# Altium schematic sheet Bloc diagram.SchDoc
size A3; SheetNumber: 2; SheetTotal: 5
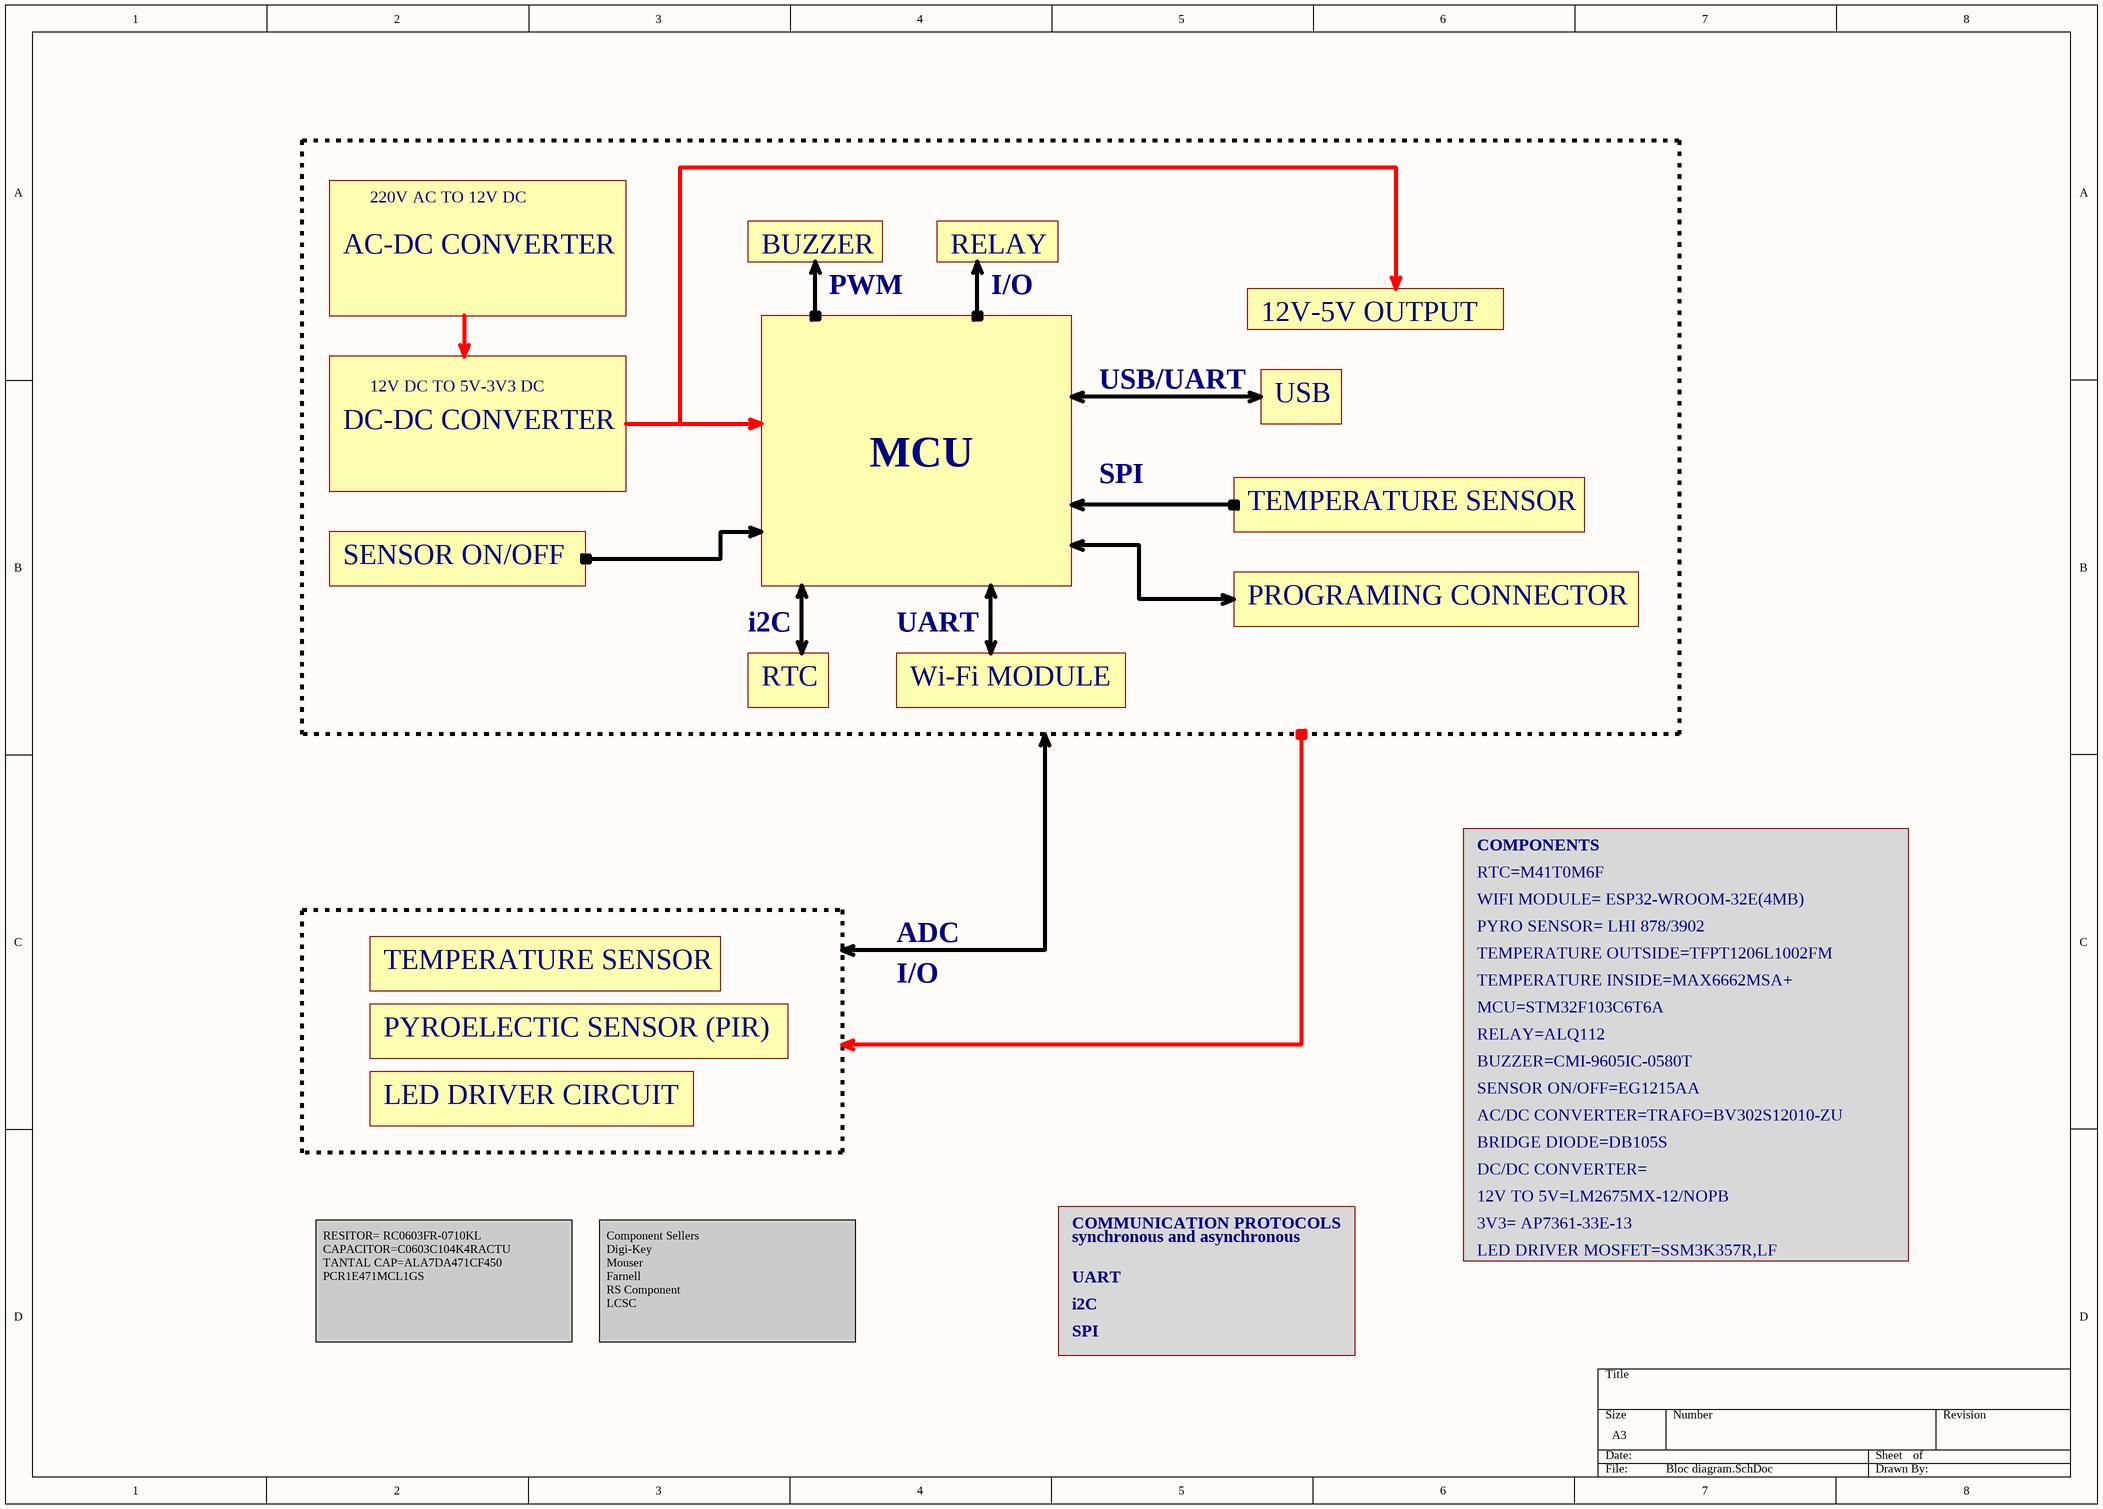
[diagram p0: Bloc diagram.SchDoc]

## Notes on the sheet
- 220V AC TO 12V DC
- AC-DC CONVERTER
- BUZZER
- PWM
- RELAY
- I/O
- 12V-5V OUTPUT
- DC-DC CONVERTER
- 12V DC TO 5V-3V3 DC
- USB/UART
- USB
- MCU
- SPI
- TEMPERATURE SENSOR
- SENSOR ON/OFF
- i2C
- UART
- PROGRAMING CONNECTOR
- RTC
- Wi-Fi MODULE
- COMPONENTS
- RTC=M41T0M6F
- WIFI MODULE= ESP32-WROOM-32E(4MB)
- ADC
- PYRO SENSOR= LHI 878/3902
- TEMPERATURE OUTSIDE=TFPT1206L1002FM
- TEMPERATURE INSIDE=MAX6662MSA+
- PYROELECTIC SENSOR (PIR)
- MCU=STM32F103C6T6A
- RELAY=ALQ112
- LED DRIVER CIRCUIT
- BUZZER=CMI-9605IC-0580T
- SENSOR ON/OFF=EG1215AA
- AC/DC CONVERTER=TRAFO=BV302S12010-ZU
- DC/DC CONVERTER=
- BRIDGE DIODE=DB105S
- COMMUNICATION PROTOCOLS
- synchronous and asynchronous
- LED DRIVER MOSFET=SSM3K357R,LF
- 12V TO 5V=LM2675MX-12/NOPB
- 3V3= AP7361-33E-13
- RESITOR= RC0603FR-0710KL
  CAPACITOR=C0603C104K4RACTU
  TANTAL CAP=ALA7DA471CF450
  PCR1E471MCL1GS
- Component Sellers
  Digi-Key
  Mouser
  Farnell
  RS Component
  LCSC